# EAGLE design trinkit (EAGLE 7.4.0)

## Sheet 1 of 2
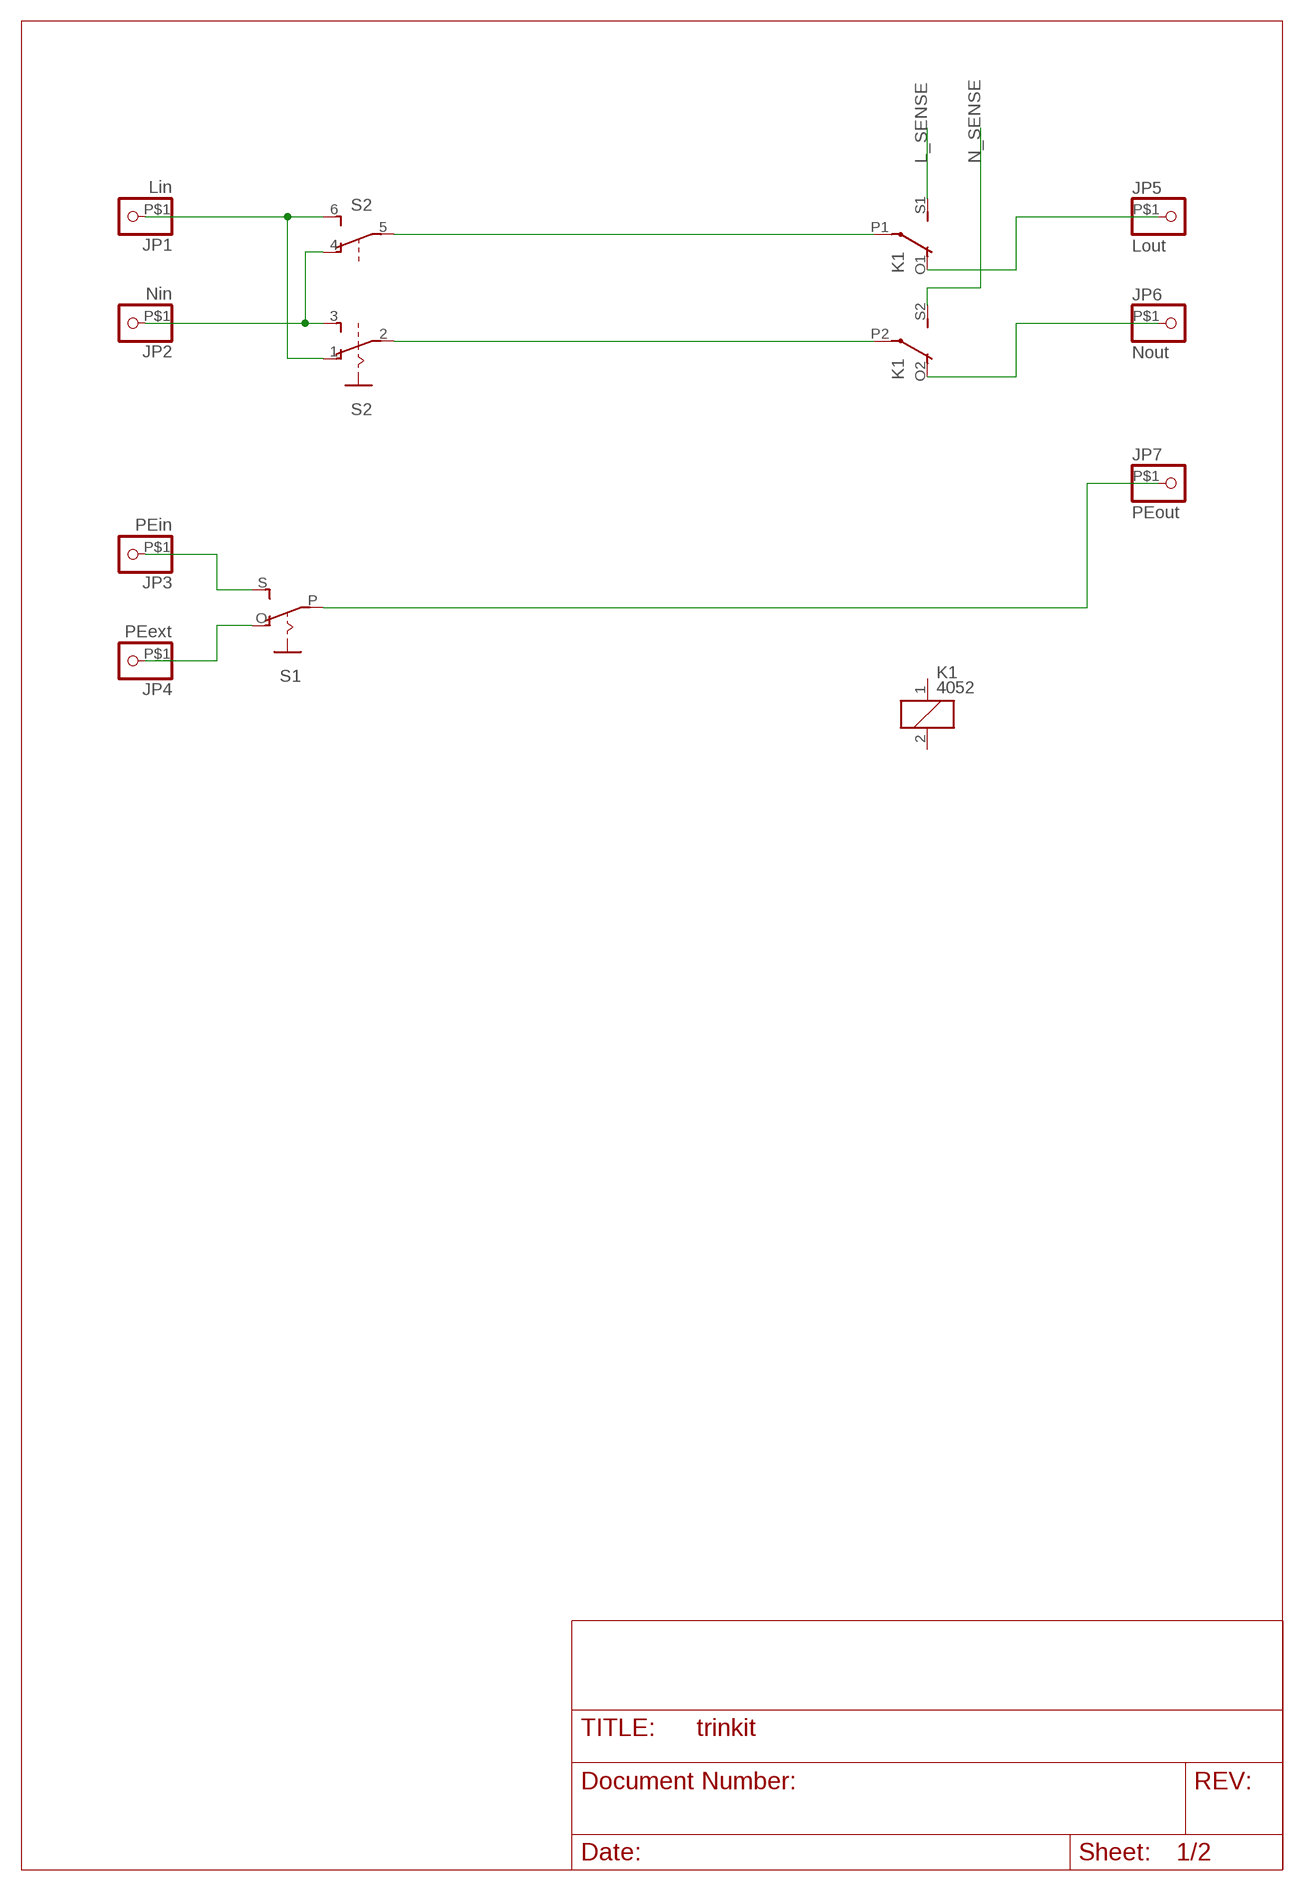
[diagram p0: schematic, sheet 1]

### Parts
JP1  Lin  PINHD-1X1-BIGPOGO  [1X1-BIGPOGO]
JP2  Nin  PINHD-1X1-BIGPOGO  [1X1-BIGPOGO]
JP3  PEin  PINHD-1X1-BIGPOGO  [1X1-BIGPOGO]
JP4  PEext  PINHD-1X1-BIGPOGO  [1X1-BIGPOGO]
JP5  Lout  PINHD-1X1-BIGPOGO  [1X1-BIGPOGO]
JP6  Nout  PINHD-1X1-BIGPOGO  [1X1-BIGPOGO]
JP7  PEout  PINHD-1X1-BIGPOGO  [1X1-BIGPOGO]
K1  4052  [F4052]
S1  EG1218S  [EG1218]
S2  A68-A31  [A68-A31]

### Nets
L_SENSE: K1.S1(2:S)
N$15: K1.P1(2:P) S2.5(B:P)
N$16: K1.P2(3:P) S2.2(A:P)
N$17: JP1.P$1 S2.1(A:O) S2.6(B:S)
N$18: JP2.P$1 S2.3(A:S) S2.4(B:O)
N$19: JP5.P$1 K1.O1(2:O)
N$20: JP6.P$1 K1.O2(3:O)
N$21: JP3.P$1 S1.S
N$22: JP4.P$1 S1.O
N$23: JP7.P$1 S1.P
N_SENSE: K1.S2(3:S)
Unconnected: K1.1 K1.2

## Sheet 2 of 2
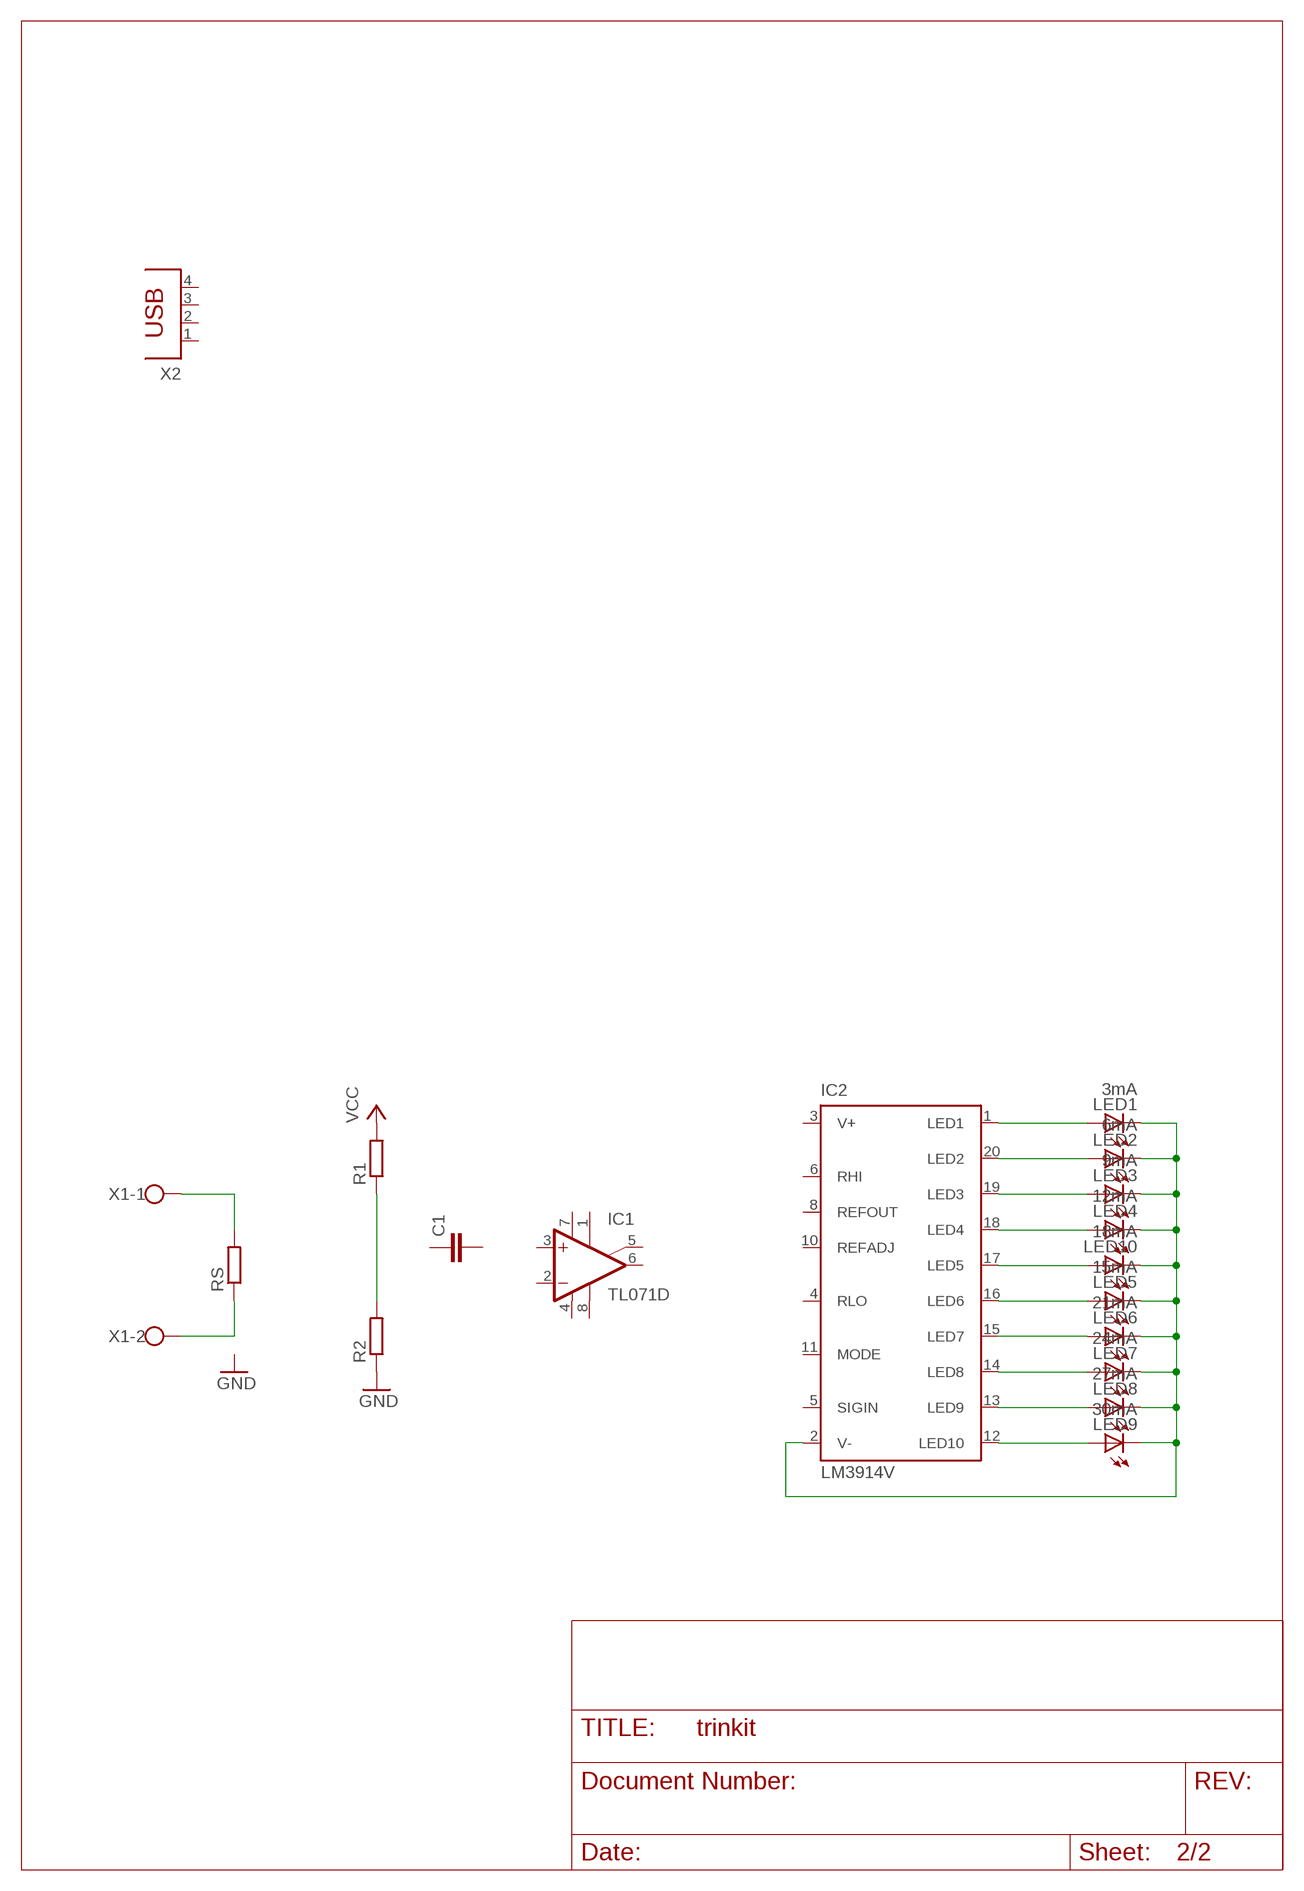
[diagram p1: schematic, sheet 2]

### Parts
C1  C-EUC0805  [C0805]
IC1  TL071D  [SO08]
IC2  LM3914V  [PLCC20S]
LED1  3mA  LEDCHIP-LED0805  [CHIP-LED0805]
LED2  6mA  LEDCHIP-LED0805  [CHIP-LED0805]
LED3  9mA  LEDCHIP-LED0805  [CHIP-LED0805]
LED4  12mA  LEDCHIP-LED0805  [CHIP-LED0805]
LED5  15mA  LEDCHIP-LED0805  [CHIP-LED0805]
LED6  21mA  LEDCHIP-LED0805  [CHIP-LED0805]
LED7  24mA  LEDCHIP-LED0805  [CHIP-LED0805]
LED8  27mA  LEDCHIP-LED0805  [CHIP-LED0805]
LED9  30mA  LEDCHIP-LED0805  [CHIP-LED0805]
LED10  18mA  LEDCHIP-LED0805  [CHIP-LED0805]
R1  R-EU_M0805  [M0805]
R2  R-EU_M0805  [M0805]
RS  R-EU_M2309  [M2309]
X1  W237-102  [W237-102]
X2  PN87520  [PN87520]

### Nets
GND: R2.1
N$1: IC2.1(LED1) LED1.A
N$2: IC2.20(LED2) LED2.A
N$3: IC2.19(LED3) LED3.A
N$4: IC2.18(LED4) LED4.A
N$5: IC2.17(LED5) LED10.A
N$6: IC2.16(LED6) LED5.A
N$7: IC2.15(LED7) LED6.A
N$8: IC2.14(LED8) LED7.A
N$9: IC2.13(LED9) LED8.A
N$10: IC2.12(LED10) LED9.A
N$11: IC2.2(V-) LED1.C LED2.C LED3.C LED4.C LED5.C LED6.C LED7.C LED8.C LED9.C LED10.C
N$12: RS.2 X1.1
N$13: RS.1 X1.2
N$14: R1.1 R2.2
VCC: R1.2
Unconnected: C1.1 C1.2 IC1.1(ON1) IC1.2(-IN) IC1.3(+IN) IC1.5(ON2) IC1.6(OUT) IC1.8(OPT) IC2.4(RLO) IC2.5(SIGIN) IC2.6(RHI) IC2.8(REFOUT) IC2.10(REFADJ) IC2.11(MODE) X2.1 X2.2 X2.3 X2.4

## Power pins joined to a net without a drawn wire
V+: IC1.7(V+) IC2.3(V+)
V-: IC1.4(V-)

## Library data of the parts
C1 = rcl:C-EU: CAPACITOR, European symbol
IC1 = linear:TL071: OP AMP
IC2 = national-semiconductor:LM391: Dot/Bar Display Driver Source: Data sheet LM3915 <http://www.national.com/ds/LM/LM3915.pdf> Data sheet LM3914 <http://www.national.com/ds/LM/LM3914.pdf>
JP1-JP7 = adafruit:PINHD-1X1: Pin header 1x1 for 0.1" spacing With round pins
K1 = relay:4052: RELAY 2 x switch, Finder; OC_FARNELL: unknown; OC_NEWARK: unknown
LED1-LED10 = led:LED: LED OSRAM: - CHIPLED LG R971, LG N971, LY N971, LG Q971, LY Q971, LO R971, LY R971 LH N974, LH R974 LS Q976, LO Q976, LY Q976 LO Q996 - Hyper CHIPLED LW Q18S LB Q993, LB Q99A, LB R99A - SideLED LS A670, LO A670, LY A670, LG A670, LP A670 LB A673, LV A673, LT A673, LW A673 LH A674 LY A675 LS A676, LA A676, LO A676, LY A676, LW A676 LS A679, LY A679, LG A679 - Hyper Micro SIDELED® LS Y876, LA Y876, LO Y876, LY Y876 LT Y87S - SmartLED LW L88C, LW L88S LB L89C, LB L89S, LG L890 LS L89K, LO L89K, LY L89K LS L896, LA L896, LO L896, LY L896 - TOPLED LS T670, LO T670, LY T670, LG T670, LP T670 LSG T670, LSP T670, LSY T670, LOP T670, LYG T670 LG T671, LOG T671, LSG T671 LB T673, LV T673, LT T673, LW T673 LH T674 LS T676, LA T676, LO T676, LY T676, LB T676, LH T676, LSB T676, LW T676 LB T67C, LV T67C, LT T67C, LS T67K, LO T67K, LY T67K, LW E67C LS E67B, LA E67B, LO E67B, LY E67B, LB E67C, LV E67C, LT E67C LW T67C LS T679, LY T679, LG T679 LS T770, LO T770, LY T770, LG T770, LP T770 LB T773, LV T773, LT T773, LW T773 LH T774 LS E675, LA E675, LY E675, LS T675 LS T776, LA T776, LO T776, LY T776, LB T776 LHGB T686 LT T68C, LB T68C - Hyper Mini TOPLED® LB M676 - Mini TOPLED Santana® LG M470 LS M47K, LO M47K, LY M47K Source: http://www.osram.convergy.de LUXEON: - LUMILED® LXK2-PW12-R00, LXK2-PW12-S00, LXK2-PW14-U00, LXK2-PW14-V00 LXK2-PM12-R00, LXK2-PM12-S00, LXK2-PM14-U00 LXK2-PE12-Q00, LXK2-PE12-R00, LXK2-PE12-S00, LXK2-PE14-T00, LXK2-PE14-U00 LXK2-PB12-K00, LXK2-PB12-L00, LXK2-PB12-M00, LXK2-PB14-N00, LXK2-PB14-P00, LXK2-PB14-Q00 LXK2-PR12-L00, LXK2-PR12-M00, LXK2-PR14-Q00, LXK2-PR14-R00 LXK2-PD12-Q00, LXK2-PD12-R00, LXK2-PD12-S00 LXK2-PH12-R00, LXK2-PH12-S00 LXK2-PL12-P00, LXK2-PL12-Q00, LXK2-PL12-R00 Source: www.luxeon.com KINGBRIGHT: KA-3528ASYC Source: www.kingbright.com
R1 R2 RS = rcl:R-EU_: RESISTOR, European symbol
S1 = adafruit:EG1218: SLIDING SWITCH 0.1" spacing through hole, vertical SPDT slide switch http://www.ladyada.net/library/pcb/eaglelibrary.html
S2 = switch:A68-A31: SLIDING SWITCH Siemens, distributor Buerklin, 11G766
X1 = con-wago-500:W237-102: WAGO SCREW CLAMP; MPN: 237-102; OC_FARNELL: unknown; OC_NEWARK: 70K9898
X2 = con-berg:PN87520: BERG USB connector; OC_FARNELL: unknown; OC_NEWARK: unknown

## Board
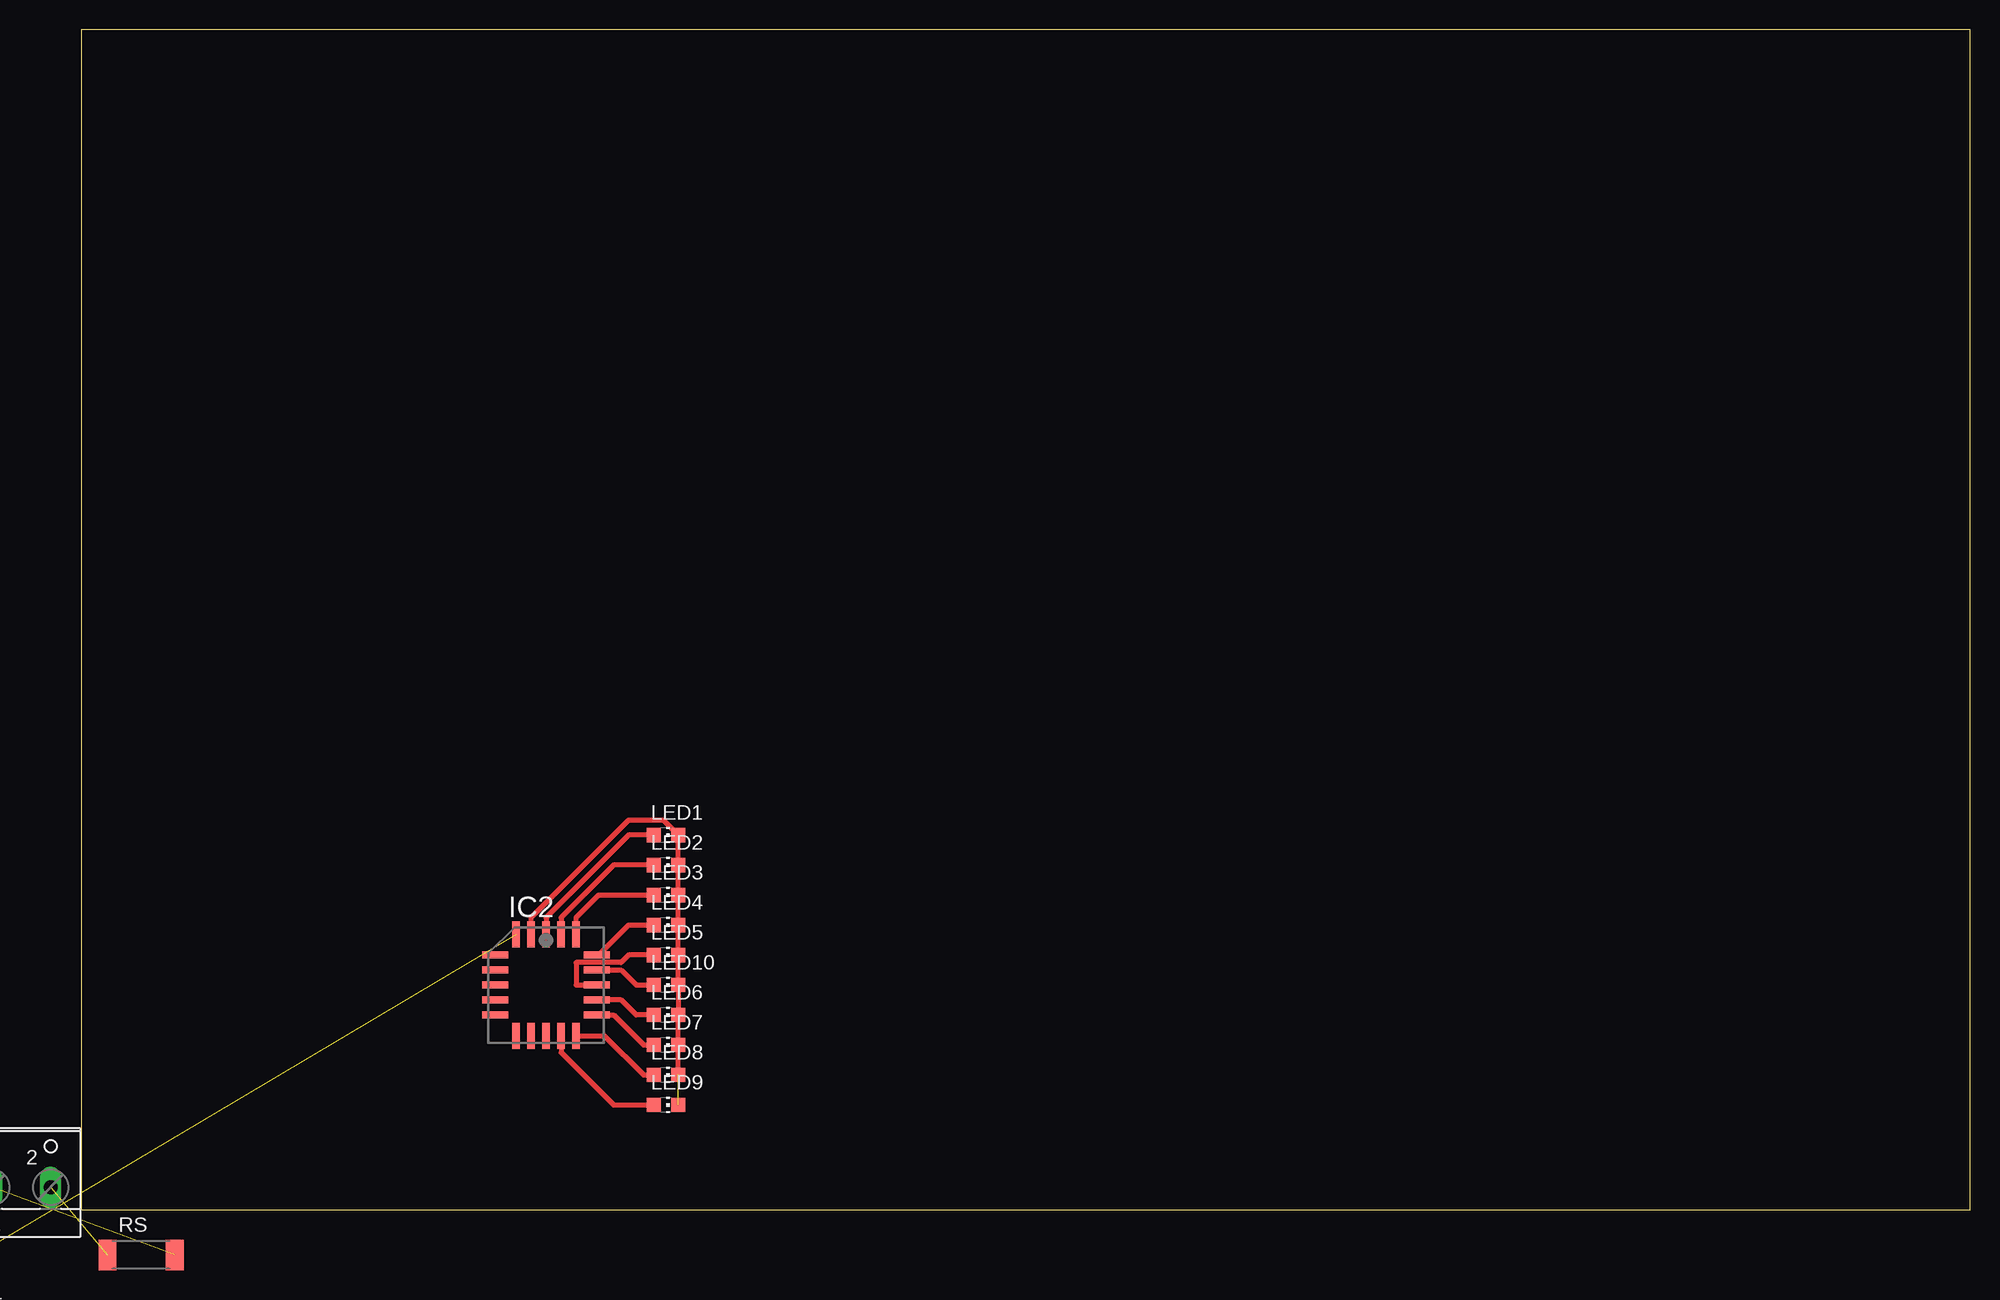
[diagram p2: board, top side]

Size 160 x 100 mm. Coordinates in mm from the lower left corner, seen from the top.
Outline: 0,0 160,0 160,100 0,100 0,0
Copper layers (1*16): Top 0.035mm / dielectric 1.5mm / Bottom 0.035mm
Design rules "default": minimum track width 10mil, minimum drill 24mil, track to track 8mil, track to pad 8mil, pad to pad 8mil, via to via 8mil, smd to smd 8mil, copper to edge 40mil, drill to drill 8mil, minimum pad ring 10mil, minimum via ring 8mil, stop-mask expansion 4mil, vias tented up to drill 0mil, thermal gap 10mil

### Footprints (pad centres in the part's own frame; a part is rotated, then mirrored left to right if it is on the bottom)
C0805 = smd 1.3 x 1.5: 1 -0.95,0; 2 0.95,0
SO08 = smd 0.6 x 2.2: 1 -1.905,-2.6; 2 -0.635,-2.6; 3 0.635,-2.6; 4 1.905,-2.6; 5 1.905,2.6; 6 0.635,2.6; 7 -0.635,2.6; 8 -1.905,2.6
PLCC20S = smd 0.6 x 2.2: 1 0,4.3; 2 -1.27,4.3; 3 -2.54,4.3; 9 -2.54,-4.3; 10 -1.27,-4.3; 11 0,-4.3; 12 1.27,-4.3; 13 2.54,-4.3; 19 2.54,4.3; 20 1.27,4.3 | smd 2.2 x 0.6: 4 -4.3,2.54; 5 -4.3,1.27; 6 -4.3,0; 7 -4.3,-1.27; 8 -4.3,-2.54; 14 4.3,-2.54; 15 4.3,-1.27; 16 4.3,0; 17 4.3,1.27; 18 4.3,2.54
1X1-BIGPOGO = drill 1.4 pad 2.54 long: P$1 0,0
F4052 = drill 1.321 long: 1 -3.81,3.81; 2 -3.81,-3.81; O1 11.43,-3.81; O2 11.43,3.81; P1 16.51,-3.81; P2 16.51,3.81; S1 21.59,-3.81; S2 21.59,3.81
CHIP-LED0805 = smd 1.2 x 1.2: A 0,-1.05; C 0,1.05
M0805 = smd 1.3 x 1.6: 1 -0.95,0; 2 0.95,0
M2309 = smd 1.5 x 2.6: 1 -2.85,0; 2 2.85,0
EG1218 = drill 0.9 pad 1.676: O -2.54,0; P 0,0; S 2.54,0
A68-A31 = drill 0.813 long: 1 -2.54,-2.54; 2 0,-2.54; 3 2.54,-2.54; 4 -2.54,2.54; 5 0,2.54; 6 2.54,2.54
W237-102 = drill 1.194 long: 1 -2.5,-1.27; 2 2.5,-1.27
PN87520 = drill 0.95 long: 1 -3.5,2.71; 2 -1,2.71; 3 1,2.71; 4 3.5,2.71 | hole 2.3: -6.57,0; 6.57,0

### Placement (x,y rotation side)
C1  -16.51,-17.78 0 top  (outside the outline)
IC1  -14.61,-10.16 0 top  (outside the outline)
IC2  39.37,19.05 0 top
JP1  16.51,-79.38 90 top  (outside the outline)
JP2  21.59,-79.38 90 top  (outside the outline)
JP3  -30.48,-61.59 0 top  (outside the outline)
JP4  -30.48,-53.98 0 top  (outside the outline)
JP5  -4.45,-60.33 90 top  (outside the outline)
JP6  -0.64,-60.33 90 top  (outside the outline)
JP7  -30.48,-57.78 0 top  (outside the outline)
K1  -12.06,-72.39 0 top  (outside the outline)
LED1  49.53,31.75 270 top
LED2  49.53,29.21 270 top
LED3  49.53,26.67 270 top
LED4  49.53,24.13 270 top
LED5  49.53,21.59 270 top
LED6  49.53,16.51 270 top
LED7  49.53,13.97 270 top
LED8  49.53,11.43 270 top
LED9  49.53,8.89 270 top
LED10  49.53,19.05 270 top
R1  -7.62,-8.89 0 top  (outside the outline)
R2  -7.62,-13.34 0 top  (outside the outline)
RS  5.08,-3.81 0 top  (outside the outline)
S1  -36.83,-57.78 270 top  (outside the outline)
S2  19.05,-72.39 180 top  (outside the outline)
X1  -5.08,3.17 0 top
X2  -10.79,-103.5 0 top  (outside the outline)

### Tracks (layer width: path | path; a pad name or v marks a point on that pad's centre or on a via)
N$1
  Top 0.406: LED1.A 46.35,31.75 39.37,24.77 IC2.1
N$2
  Top 0.406: LED2.A 45.09,29.21 40.64,24.77 IC2.20
N$3
  Top 0.406: IC2.19 41.91,24.77 43.81,26.67 LED3.A
N$4
  Top 0.406: IC2.18 43.81,21.59 46.35,24.13 LED4.A
N$5
  Top 0.406: IC2.17 45.72,20.32 46.99,19.05 LED10.A
N$6
  Top 0.406: LED5.A 46.35,21.59 45.72,20.95 41.91,20.95 41.91,19.05 IC2.16
N$7
  Top 0.406: LED6.A 46.99,16.51 45.72,17.78 IC2.15
N$8
  Top 0.406: IC2.14 45.09,16.51 47.62,13.97 LED7.A
N$9
  Top 0.406: IC2.13 44.3,14.75 47.62,11.43 LED8.A
N$10
  Top 0.406: IC2.12 40.64,13.34 45.09,8.89 LED9.A
N$11  (1 unrouted)
  Top 0.406: LED8.C LED7.C LED6.C LED10.C LED5.C LED4.C LED3.C LED2.C LED1.C 49.31,33.02 46.35,33.02 38.1,24.77 IC2.2
N$12  (1 unrouted)
N$13  (1 unrouted)
N$14  (1 unrouted)
N$15  (1 unrouted)
N$16  (1 unrouted)
N$17  (2 unrouted)
N$18  (2 unrouted)
N$19  (1 unrouted)
N$20  (1 unrouted)
N$21  (1 unrouted)
N$22  (1 unrouted)
N$23  (1 unrouted)
V+  (1 unrouted)